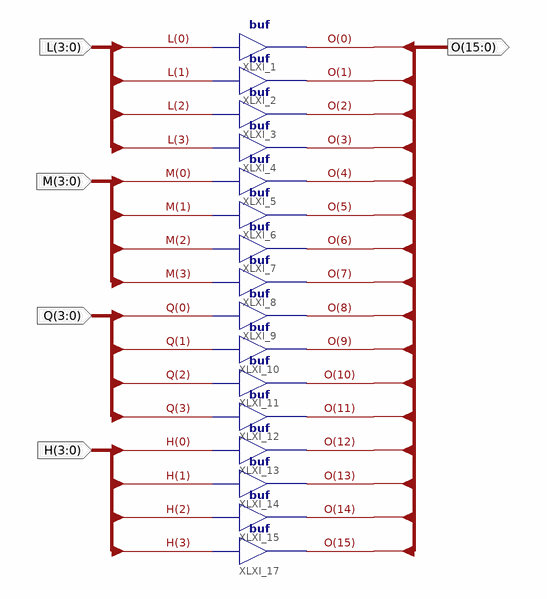
[diagram p0: schematic sheet 1]
// Xilinx ISE schematic splice4x4x4x4x16.sch (spartan6) as structural Verilog: 16 symbols, 5 ports
module splice4x4x4x4x16 (
  input  [3:0] Q,
  input  [3:0] L,
  input  [3:0] M,
  input  [3:0] H,
  output [15:0] O
);

  buf XLXI_1 (O[0], L[0]);
  buf XLXI_2 (O[1], L[1]);
  buf XLXI_3 (O[2], L[2]);
  buf XLXI_4 (O[3], L[3]);
  buf XLXI_5 (O[4], M[0]);
  buf XLXI_6 (O[5], M[1]);
  buf XLXI_7 (O[6], M[2]);
  buf XLXI_8 (O[7], M[3]);
  buf XLXI_9 (O[8], Q[0]);
  buf XLXI_10 (O[9], Q[1]);
  buf XLXI_11 (O[10], Q[2]);
  buf XLXI_12 (O[11], Q[3]);
  buf XLXI_13 (O[12], H[0]);
  buf XLXI_14 (O[13], H[1]);
  buf XLXI_15 (O[14], H[2]);
  buf XLXI_17 (O[15], H[3]);
endmodule
